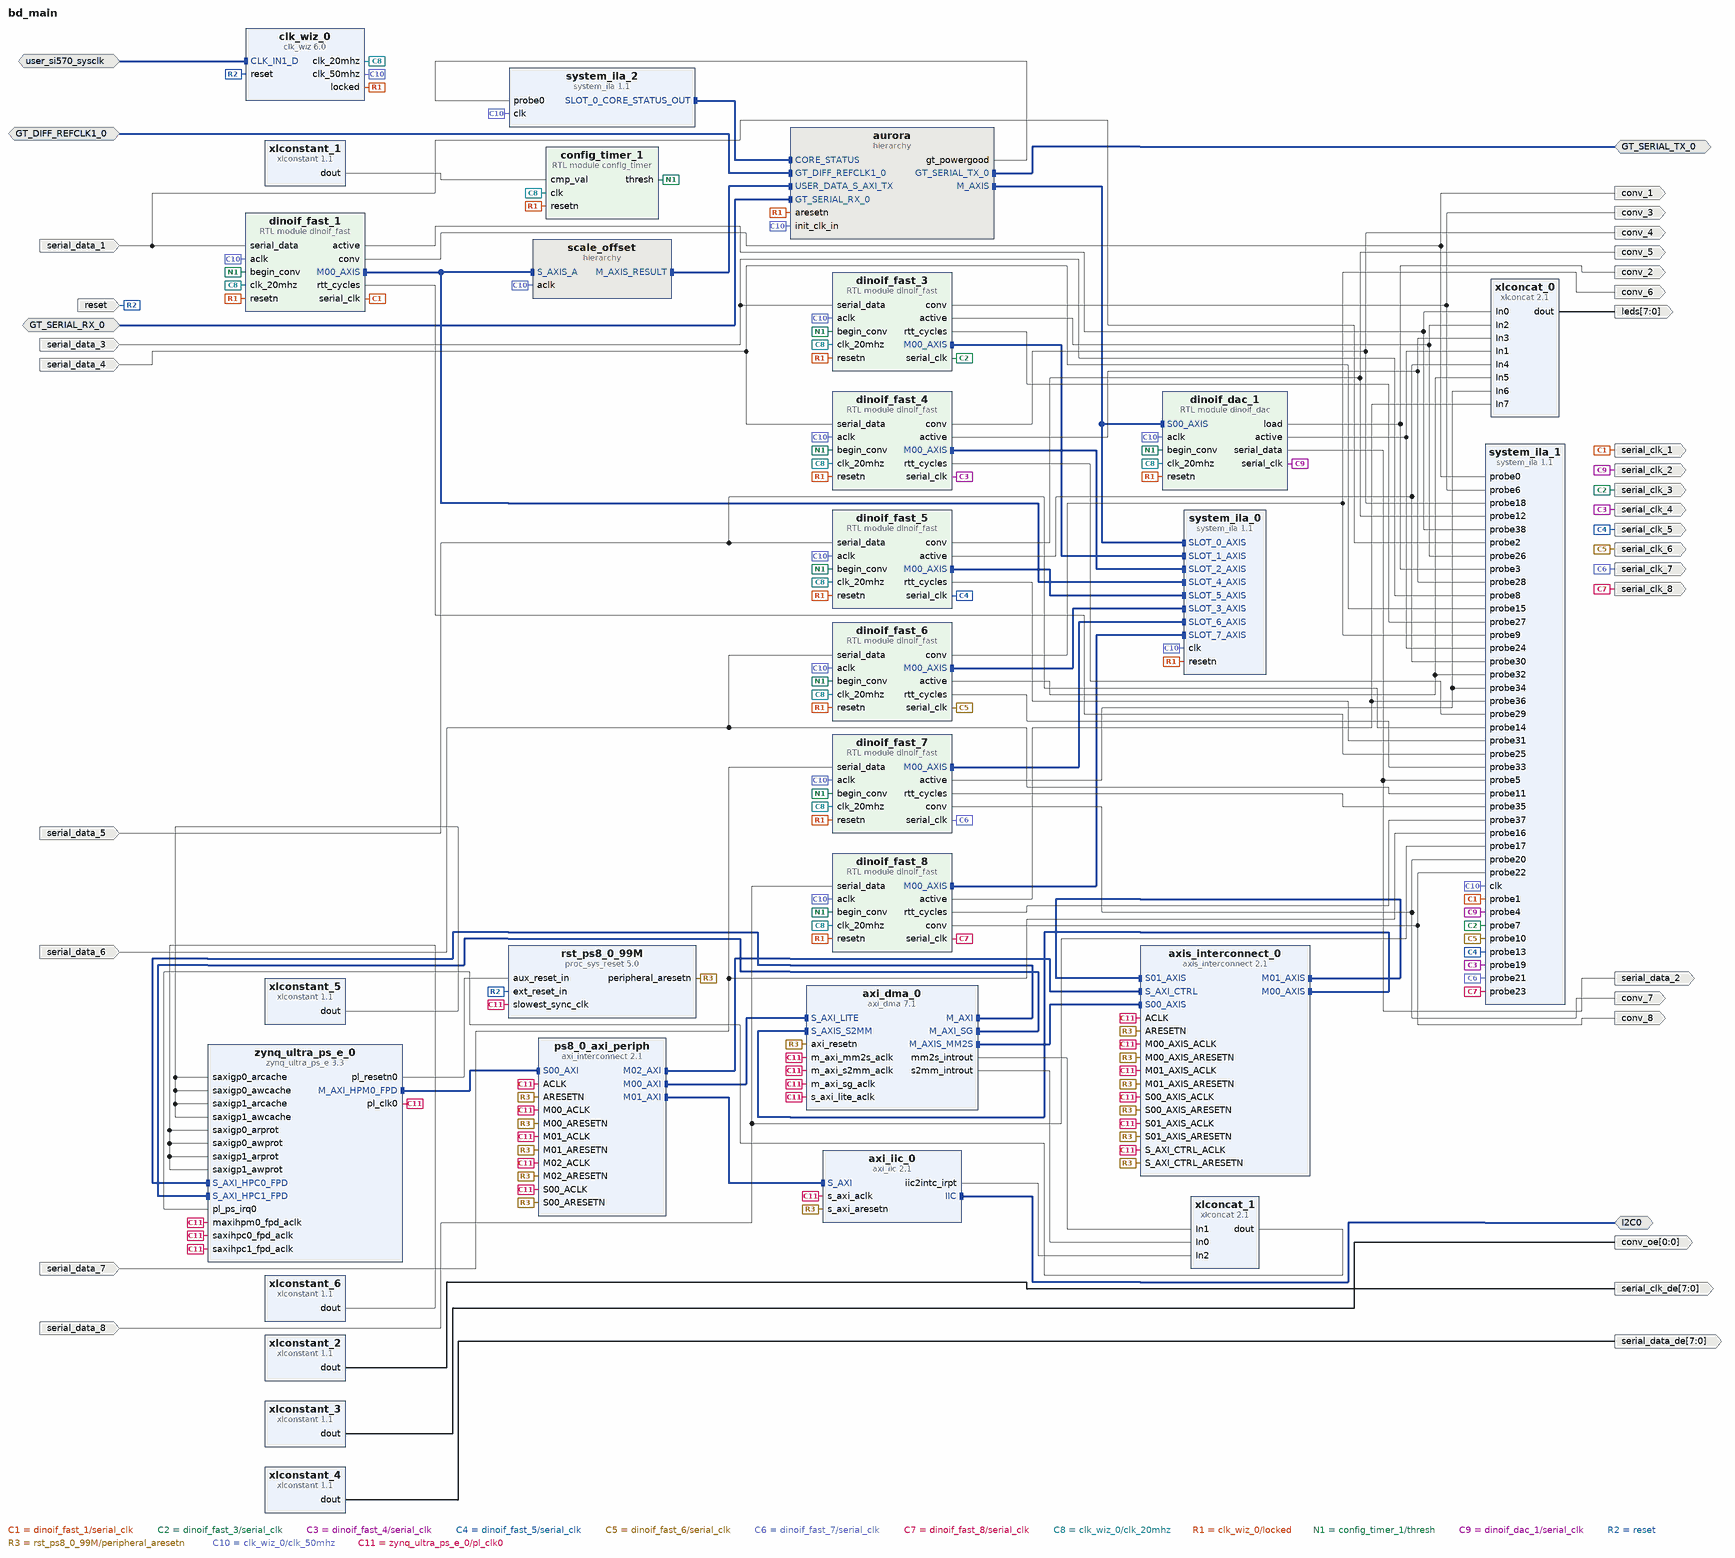
[diagram p0: block diagram of the top level]
# Vivado block design bd_main, xczu7ev-ffvc1156-2-e, Vivado 2021.1
create_bd_design bd_main

create_bd_intf_port -mode Slave -vlnv xilinx.com:interface:diff_clock_rtl:1.0 user_si570_sysclk
set_property -dict {CONFIG.FREQ_HZ 300000000} [get_bd_intf_ports user_si570_sysclk]
create_bd_intf_port -mode Slave -vlnv xilinx.com:display_aurora:GT_Serial_Transceiver_Pins_RX_rtl:1.0 GT_SERIAL_RX_0
create_bd_intf_port -mode Slave -vlnv xilinx.com:interface:diff_clock_rtl:1.0 GT_DIFF_REFCLK1_0
set_property -dict {CONFIG.FREQ_HZ 250000000} [get_bd_intf_ports GT_DIFF_REFCLK1_0]
create_bd_intf_port -mode Master -vlnv xilinx.com:display_aurora:GT_Serial_Transceiver_Pins_TX_rtl:1.0 GT_SERIAL_TX_0
create_bd_intf_port -mode Master -vlnv xilinx.com:interface:iic_rtl:1.0 I2C0
create_bd_port -dir O conv_3
create_bd_port -dir O conv_2
create_bd_port -dir O -type clk serial_clk_3
set_property -dict {CONFIG.FREQ_HZ 20000000} [get_bd_ports serial_clk_3]
create_bd_port -dir O -type clk serial_clk_2
create_bd_port -dir O -from 7 -to 0 serial_clk_de
create_bd_port -dir O -from 0 -to 0 conv_oe
create_bd_port -dir O -from 7 -to 0 serial_data_de
create_bd_port -dir O conv_1
create_bd_port -dir O -type clk serial_clk_1
set_property -dict {CONFIG.FREQ_HZ 20000000} [get_bd_ports serial_clk_1]
create_bd_port -dir O conv_5
create_bd_port -dir O -type clk serial_clk_5
set_property -dict {CONFIG.FREQ_HZ 20000000} [get_bd_ports serial_clk_5]
create_bd_port -dir O conv_6
create_bd_port -dir O -type clk serial_clk_6
set_property -dict {CONFIG.FREQ_HZ 20000000} [get_bd_ports serial_clk_6]
create_bd_port -dir I serial_data_5
create_bd_port -dir I serial_data_6
create_bd_port -dir I serial_data_1
create_bd_port -dir I serial_data_3
create_bd_port -dir I -type rst reset
set_property -dict {CONFIG.POLARITY ACTIVE_HIGH} [get_bd_ports reset]
create_bd_port -dir O conv_4
create_bd_port -dir O -type clk serial_clk_4
set_property -dict {CONFIG.FREQ_HZ 20000000} [get_bd_ports serial_clk_4]
create_bd_port -dir O conv_7
create_bd_port -dir O -type clk serial_clk_7
set_property -dict {CONFIG.FREQ_HZ 20000000} [get_bd_ports serial_clk_7]
create_bd_port -dir O conv_8
create_bd_port -dir O -type clk serial_clk_8
set_property -dict {CONFIG.FREQ_HZ 20000000} [get_bd_ports serial_clk_8]
create_bd_port -dir I serial_data_4
create_bd_port -dir I serial_data_7
create_bd_port -dir I serial_data_8
create_bd_port -dir O -from 7 -to 0 leds
create_bd_port -dir O serial_data_2

create_bd_cell -type module -reference config_timer config_timer_1
create_bd_cell -type ip -vlnv xilinx.com:ip:xlconstant:1.1 xlconstant_1
set_property -dict {CONFIG.CONST_VAL 1000 CONFIG.CONST_WIDTH 32} [get_bd_cells xlconstant_1]
create_bd_cell -type ip -vlnv xilinx.com:ip:system_ila:1.1 system_ila_0
set_property -dict [list \
  CONFIG.C_DATA_DEPTH 8192 \
  CONFIG.C_MON_TYPE INTERFACE \
  CONFIG.C_NUM_MONITOR_SLOTS 8 \
  CONFIG.C_NUM_OF_PROBES 0 \
  CONFIG.C_SLOT 2 \
  CONFIG.C_SLOT_0_INTF_TYPE xilinx.com:interface:axis_rtl:1.0 \
  CONFIG.C_SLOT_1_INTF_TYPE xilinx.com:interface:axis_rtl:1.0 \
  CONFIG.C_SLOT_2_INTF_TYPE xilinx.com:interface:axis_rtl:1.0 \
  CONFIG.C_SLOT_3_INTF_TYPE xilinx.com:interface:axis_rtl:1.0 \
  CONFIG.C_SLOT_4_INTF_TYPE xilinx.com:interface:axis_rtl:1.0 \
  CONFIG.C_SLOT_5_INTF_TYPE xilinx.com:interface:axis_rtl:1.0 \
  CONFIG.C_SLOT_6_INTF_TYPE xilinx.com:interface:axis_rtl:1.0 \
  CONFIG.C_SLOT_7_INTF_TYPE xilinx.com:interface:axis_rtl:1.0 \
  CONFIG.C_SLOT_8_INTF_TYPE xilinx.com:interface:axis_rtl:1.0 \
] [get_bd_cells system_ila_0]
create_bd_cell -type ip -vlnv xilinx.com:ip:xlconstant:1.1 xlconstant_2
set_property -dict {CONFIG.CONST_VAL 0xFF CONFIG.CONST_WIDTH 8} [get_bd_cells xlconstant_2]
create_bd_cell -type ip -vlnv xilinx.com:ip:system_ila:1.1 system_ila_1
set_property -dict {CONFIG.C_DATA_DEPTH 8192 CONFIG.C_MON_TYPE NATIVE CONFIG.C_NUM_OF_PROBES 39} [get_bd_cells system_ila_1]
create_bd_cell -type ip -vlnv xilinx.com:ip:xlconstant:1.1 xlconstant_3
set_property -dict {CONFIG.CONST_VAL 1 CONFIG.CONST_WIDTH 1} [get_bd_cells xlconstant_3]
create_bd_cell -type ip -vlnv xilinx.com:ip:xlconstant:1.1 xlconstant_4
set_property -dict {CONFIG.CONST_VAL 0b00000010 CONFIG.CONST_WIDTH 8} [get_bd_cells xlconstant_4]
create_bd_cell -type ip -vlnv xilinx.com:ip:clk_wiz:6.0 clk_wiz_0
set_property -dict [list \
  CONFIG.CLKIN1_JITTER_PS 33.330000000000005 \
  CONFIG.CLKOUT1_JITTER 140.023 \
  CONFIG.CLKOUT1_PHASE_ERROR 77.836 \
  CONFIG.CLKOUT1_REQUESTED_OUT_FREQ 20.000 \
  CONFIG.CLKOUT2_JITTER 116.415 \
  CONFIG.CLKOUT2_PHASE_ERROR 77.836 \
  CONFIG.CLKOUT2_REQUESTED_OUT_FREQ 50.000 \
  CONFIG.CLKOUT2_USED true \
  CONFIG.CLK_IN1_BOARD_INTERFACE user_si570_sysclk \
  CONFIG.CLK_OUT1_PORT clk_20mhz \
  CONFIG.CLK_OUT2_PORT clk_50mhz \
  CONFIG.MMCM_CLKFBOUT_MULT_F 4.000 \
  CONFIG.MMCM_CLKIN1_PERIOD 3.333 \
  CONFIG.MMCM_CLKIN2_PERIOD 10.0 \
  CONFIG.MMCM_CLKOUT0_DIVIDE_F 60.000 \
  CONFIG.MMCM_CLKOUT1_DIVIDE 24 \
  CONFIG.MMCM_DIVCLK_DIVIDE 1 \
  CONFIG.NUM_OUT_CLKS 2 \
  CONFIG.PRIM_SOURCE Differential_clock_capable_pin \
  CONFIG.RESET_BOARD_INTERFACE reset \
  CONFIG.USE_BOARD_FLOW true \
] [get_bd_cells clk_wiz_0]
create_bd_cell -type hier scale_offset
create_bd_cell -type ip -vlnv xilinx.com:ip:system_ila:1.1 system_ila_2
set_property -dict [list \
  CONFIG.C_DATA_DEPTH 8192 \
  CONFIG.C_MON_TYPE MIX \
  CONFIG.C_NUM_MONITOR_SLOTS 1 \
  CONFIG.C_NUM_OF_PROBES 1 \
  CONFIG.C_SLOT_0_INTF_TYPE xilinx.com:display_aurora:core_status_out_rtl:1.0 \
] [get_bd_cells system_ila_2]
create_bd_cell -type hier aurora
create_bd_cell -type ip -vlnv xilinx.com:ip:xlconcat:2.1 xlconcat_0
set_property -dict {CONFIG.NUM_PORTS 8} [get_bd_cells xlconcat_0]
create_bd_cell -type ip -vlnv xilinx.com:ip:proc_sys_reset:5.0 rst_ps8_0_99M
set_property -dict {CONFIG.RESET_BOARD_INTERFACE reset CONFIG.USE_BOARD_FLOW true} [get_bd_cells rst_ps8_0_99M]
create_bd_cell -type ip -vlnv xilinx.com:ip:zynq_ultra_ps_e:3.3 zynq_ultra_ps_e_0
set_property -dict [list \
  CONFIG.PSU_BANK_0_IO_STANDARD LVCMOS18 \
  CONFIG.PSU_BANK_1_IO_STANDARD LVCMOS18 \
  CONFIG.PSU_BANK_2_IO_STANDARD LVCMOS18 \
  CONFIG.PSU_DYNAMIC_DDR_CONFIG_EN 1 \
  CONFIG.PSU_USB3__DUAL_CLOCK_ENABLE 1 \
  CONFIG.PSU__CAN1__PERIPHERAL__ENABLE 1 \
  CONFIG.PSU__CAN1__PERIPHERAL__IO {MIO 24 .. 25} \
  CONFIG.PSU__CRF_APB__ACPU_CTRL__FREQMHZ 1200 \
  CONFIG.PSU__CRF_APB__ACPU_CTRL__SRCSEL APLL \
  CONFIG.PSU__CRF_APB__APLL_CTRL__SRCSEL PSS_REF_CLK \
  CONFIG.PSU__CRF_APB__DBG_FPD_CTRL__FREQMHZ 250 \
  CONFIG.PSU__CRF_APB__DBG_FPD_CTRL__SRCSEL IOPLL \
  CONFIG.PSU__CRF_APB__DBG_TRACE_CTRL__FREQMHZ 250 \
  CONFIG.PSU__CRF_APB__DBG_TRACE_CTRL__SRCSEL IOPLL \
  CONFIG.PSU__CRF_APB__DBG_TSTMP_CTRL__FREQMHZ 250 \
  CONFIG.PSU__CRF_APB__DBG_TSTMP_CTRL__SRCSEL IOPLL \
  CONFIG.PSU__CRF_APB__DDR_CTRL__FREQMHZ 1067 \
  CONFIG.PSU__CRF_APB__DDR_CTRL__SRCSEL DPLL \
  CONFIG.PSU__CRF_APB__DPDMA_REF_CTRL__FREQMHZ 600 \
  CONFIG.PSU__CRF_APB__DPDMA_REF_CTRL__SRCSEL APLL \
  CONFIG.PSU__CRF_APB__DPLL_CTRL__SRCSEL PSS_REF_CLK \
  CONFIG.PSU__CRF_APB__DP_AUDIO_REF_CTRL__SRCSEL RPLL \
  CONFIG.PSU__CRF_APB__DP_STC_REF_CTRL__SRCSEL RPLL \
  CONFIG.PSU__CRF_APB__DP_VIDEO_REF_CTRL__SRCSEL VPLL \
  CONFIG.PSU__CRF_APB__GDMA_REF_CTRL__FREQMHZ 600 \
  CONFIG.PSU__CRF_APB__GDMA_REF_CTRL__SRCSEL APLL \
  CONFIG.PSU__CRF_APB__GPU_REF_CTRL__FREQMHZ 500 \
  CONFIG.PSU__CRF_APB__GPU_REF_CTRL__SRCSEL IOPLL \
  CONFIG.PSU__CRF_APB__TOPSW_LSBUS_CTRL__FREQMHZ 100 \
  CONFIG.PSU__CRF_APB__TOPSW_LSBUS_CTRL__SRCSEL IOPLL \
  CONFIG.PSU__CRF_APB__TOPSW_MAIN_CTRL__FREQMHZ 533.33 \
  CONFIG.PSU__CRF_APB__TOPSW_MAIN_CTRL__SRCSEL DPLL \
  CONFIG.PSU__CRF_APB__VPLL_CTRL__SRCSEL PSS_REF_CLK \
  CONFIG.PSU__CRL_APB__ADMA_REF_CTRL__FREQMHZ 500 \
  CONFIG.PSU__CRL_APB__ADMA_REF_CTRL__SRCSEL IOPLL \
  CONFIG.PSU__CRL_APB__CAN1_REF_CTRL__FREQMHZ 100 \
  CONFIG.PSU__CRL_APB__CAN1_REF_CTRL__SRCSEL IOPLL \
  CONFIG.PSU__CRL_APB__CPU_R5_CTRL__FREQMHZ 500 \
  CONFIG.PSU__CRL_APB__CPU_R5_CTRL__SRCSEL IOPLL \
  CONFIG.PSU__CRL_APB__DBG_LPD_CTRL__FREQMHZ 250 \
  CONFIG.PSU__CRL_APB__DBG_LPD_CTRL__SRCSEL IOPLL \
  CONFIG.PSU__CRL_APB__GEM3_REF_CTRL__FREQMHZ 125 \
  CONFIG.PSU__CRL_APB__GEM3_REF_CTRL__SRCSEL IOPLL \
  CONFIG.PSU__CRL_APB__I2C0_REF_CTRL__FREQMHZ 100 \
  CONFIG.PSU__CRL_APB__I2C0_REF_CTRL__SRCSEL IOPLL \
  CONFIG.PSU__CRL_APB__I2C1_REF_CTRL__FREQMHZ 100 \
  CONFIG.PSU__CRL_APB__I2C1_REF_CTRL__SRCSEL IOPLL \
  CONFIG.PSU__CRL_APB__IOPLL_CTRL__SRCSEL PSS_REF_CLK \
  CONFIG.PSU__CRL_APB__IOU_SWITCH_CTRL__FREQMHZ 250 \
  CONFIG.PSU__CRL_APB__IOU_SWITCH_CTRL__SRCSEL IOPLL \
  CONFIG.PSU__CRL_APB__LPD_LSBUS_CTRL__FREQMHZ 100 \
  CONFIG.PSU__CRL_APB__LPD_LSBUS_CTRL__SRCSEL IOPLL \
  CONFIG.PSU__CRL_APB__LPD_SWITCH_CTRL__FREQMHZ 500 \
  CONFIG.PSU__CRL_APB__LPD_SWITCH_CTRL__SRCSEL IOPLL \
  CONFIG.PSU__CRL_APB__PCAP_CTRL__FREQMHZ 200 \
  CONFIG.PSU__CRL_APB__PCAP_CTRL__SRCSEL IOPLL \
  CONFIG.PSU__CRL_APB__PL0_REF_CTRL__FREQMHZ 50 \
  CONFIG.PSU__CRL_APB__PL0_REF_CTRL__SRCSEL IOPLL \
  CONFIG.PSU__CRL_APB__QSPI_REF_CTRL__FREQMHZ 125 \
  CONFIG.PSU__CRL_APB__QSPI_REF_CTRL__SRCSEL IOPLL \
  CONFIG.PSU__CRL_APB__RPLL_CTRL__SRCSEL PSS_REF_CLK \
  CONFIG.PSU__CRL_APB__SDIO1_REF_CTRL__FREQMHZ 200 \
  CONFIG.PSU__CRL_APB__SDIO1_REF_CTRL__SRCSEL IOPLL \
  CONFIG.PSU__CRL_APB__TIMESTAMP_REF_CTRL__FREQMHZ 100 \
  CONFIG.PSU__CRL_APB__TIMESTAMP_REF_CTRL__SRCSEL IOPLL \
  CONFIG.PSU__CRL_APB__UART0_REF_CTRL__FREQMHZ 100 \
  CONFIG.PSU__CRL_APB__UART0_REF_CTRL__SRCSEL IOPLL \
  CONFIG.PSU__CRL_APB__UART1_REF_CTRL__FREQMHZ 100 \
  CONFIG.PSU__CRL_APB__UART1_REF_CTRL__SRCSEL IOPLL \
  CONFIG.PSU__CRL_APB__USB0_BUS_REF_CTRL__FREQMHZ 250 \
  CONFIG.PSU__CRL_APB__USB0_BUS_REF_CTRL__SRCSEL IOPLL \
  CONFIG.PSU__CRL_APB__USB3_DUAL_REF_CTRL__FREQMHZ 20 \
  CONFIG.PSU__CRL_APB__USB3_DUAL_REF_CTRL__SRCSEL IOPLL \
  CONFIG.PSU__CRL_APB__USB3__ENABLE 1 \
  CONFIG.PSU__CSUPMU__PERIPHERAL__VALID 1 \
  CONFIG.PSU__DDRC__BUS_WIDTH {64 Bit} \
  CONFIG.PSU__DDRC__COMPONENTS UDIMM \
  CONFIG.PSU__DDRC__DEVICE_CAPACITY {4096 MBits} \
  CONFIG.PSU__DDRC__DRAM_WIDTH {8 Bits} \
  CONFIG.PSU__DDRC__ECC Disabled \
  CONFIG.PSU__DDRC__MEMORY_TYPE {DDR 4} \
  CONFIG.PSU__DDRC__SPEED_BIN DDR4_2133P \
  CONFIG.PSU__DDR_HIGH_ADDRESS_GUI_ENABLE 1 \
  CONFIG.PSU__DDR__INTERFACE__FREQMHZ 533.500 \
  CONFIG.PSU__DISPLAYPORT__LANE0__ENABLE 1 \
  CONFIG.PSU__DISPLAYPORT__LANE0__IO {GT Lane1} \
  CONFIG.PSU__DISPLAYPORT__LANE1__ENABLE 1 \
  CONFIG.PSU__DISPLAYPORT__LANE1__IO {GT Lane0} \
  CONFIG.PSU__DISPLAYPORT__PERIPHERAL__ENABLE 1 \
  CONFIG.PSU__DLL__ISUSED 1 \
  CONFIG.PSU__DPAUX__PERIPHERAL__ENABLE 1 \
  CONFIG.PSU__DPAUX__PERIPHERAL__IO {MIO 27 .. 30} \
  CONFIG.PSU__DP__LANE_SEL {Dual Lower} \
  CONFIG.PSU__DP__REF_CLK_FREQ 27 \
  CONFIG.PSU__DP__REF_CLK_SEL {Ref Clk3} \
  CONFIG.PSU__ENET3__FIFO__ENABLE 0 \
  CONFIG.PSU__ENET3__GRP_MDIO__ENABLE 1 \
  CONFIG.PSU__ENET3__GRP_MDIO__IO {MIO 76 .. 77} \
  CONFIG.PSU__ENET3__PERIPHERAL__ENABLE 1 \
  CONFIG.PSU__ENET3__PERIPHERAL__IO {MIO 64 .. 75} \
  CONFIG.PSU__ENET3__PTP__ENABLE 0 \
  CONFIG.PSU__ENET3__TSU__ENABLE 0 \
  CONFIG.PSU__FPGA_PL0_ENABLE 1 \
  CONFIG.PSU__GEM3_COHERENCY 0 \
  CONFIG.PSU__GEM3_ROUTE_THROUGH_FPD 0 \
  CONFIG.PSU__GEM__TSU__ENABLE 0 \
  CONFIG.PSU__GPIO0_MIO__IO {MIO 0 .. 25} \
  CONFIG.PSU__GPIO0_MIO__PERIPHERAL__ENABLE 1 \
  CONFIG.PSU__GPIO1_MIO__IO {MIO 26 .. 51} \
  CONFIG.PSU__GPIO1_MIO__PERIPHERAL__ENABLE 1 \
  CONFIG.PSU__GT__LINK_SPEED HBR \
  CONFIG.PSU__GT__PRE_EMPH_LVL_4 0 \
  CONFIG.PSU__GT__VLT_SWNG_LVL_4 0 \
  CONFIG.PSU__I2C0__PERIPHERAL__ENABLE 1 \
  CONFIG.PSU__I2C0__PERIPHERAL__IO {MIO 14 .. 15} \
  CONFIG.PSU__I2C1__PERIPHERAL__ENABLE 1 \
  CONFIG.PSU__I2C1__PERIPHERAL__IO {MIO 16 .. 17} \
  CONFIG.PSU__IOU_SLCR__IOU_TTC_APB_CLK__TTC0_SEL APB \
  CONFIG.PSU__IOU_SLCR__IOU_TTC_APB_CLK__TTC1_SEL APB \
  CONFIG.PSU__IOU_SLCR__IOU_TTC_APB_CLK__TTC2_SEL APB \
  CONFIG.PSU__IOU_SLCR__IOU_TTC_APB_CLK__TTC3_SEL APB \
  CONFIG.PSU__MAXIGP0__DATA_WIDTH 128 \
  CONFIG.PSU__OVERRIDE__BASIC_CLOCK 0 \
  CONFIG.PSU__PMU_COHERENCY 0 \
  CONFIG.PSU__PMU__AIBACK__ENABLE 0 \
  CONFIG.PSU__PMU__EMIO_GPI__ENABLE 0 \
  CONFIG.PSU__PMU__EMIO_GPO__ENABLE 0 \
  CONFIG.PSU__PMU__GPI0__ENABLE 0 \
  CONFIG.PSU__PMU__GPI1__ENABLE 0 \
  CONFIG.PSU__PMU__GPI2__ENABLE 0 \
  CONFIG.PSU__PMU__GPI3__ENABLE 0 \
  CONFIG.PSU__PMU__GPI4__ENABLE 0 \
  CONFIG.PSU__PMU__GPI5__ENABLE 0 \
  CONFIG.PSU__PMU__GPO0__ENABLE 0 \
  CONFIG.PSU__PMU__GPO1__ENABLE 0 \
  CONFIG.PSU__PMU__GPO2__ENABLE 0 \
  CONFIG.PSU__PMU__GPO3__ENABLE 0 \
  CONFIG.PSU__PMU__GPO4__ENABLE 0 \
  CONFIG.PSU__PMU__GPO5__ENABLE 0 \
  CONFIG.PSU__PMU__PERIPHERAL__ENABLE 1 \
  CONFIG.PSU__PMU__PLERROR__ENABLE 0 \
  CONFIG.PSU__PRESET_APPLIED 1 \
  CONFIG.PSU__PSS_REF_CLK__FREQMHZ 33.330 \
  CONFIG.PSU__QSPI_COHERENCY 0 \
  CONFIG.PSU__QSPI_ROUTE_THROUGH_FPD 0 \
  CONFIG.PSU__QSPI__GRP_FBCLK__ENABLE 1 \
  CONFIG.PSU__QSPI__GRP_FBCLK__IO {MIO 6} \
  CONFIG.PSU__QSPI__PERIPHERAL__DATA_MODE x4 \
  CONFIG.PSU__QSPI__PERIPHERAL__ENABLE 1 \
  CONFIG.PSU__QSPI__PERIPHERAL__IO {MIO 0 .. 12} \
  CONFIG.PSU__QSPI__PERIPHERAL__MODE {Dual Parallel} \
  CONFIG.PSU__SATA__LANE1__IO {GT Lane3} \
  CONFIG.PSU__SATA__PERIPHERAL__ENABLE 1 \
  CONFIG.PSU__SATA__REF_CLK_FREQ 125 \
  CONFIG.PSU__SATA__REF_CLK_SEL {Ref Clk1} \
  CONFIG.PSU__SAXIGP1__DATA_WIDTH 32 \
  CONFIG.PSU__SD1_COHERENCY 0 \
  CONFIG.PSU__SD1_ROUTE_THROUGH_FPD 0 \
  CONFIG.PSU__SD1__DATA_TRANSFER_MODE 8Bit \
  CONFIG.PSU__SD1__GRP_CD__ENABLE 1 \
  CONFIG.PSU__SD1__GRP_CD__IO {MIO 45} \
  CONFIG.PSU__SD1__GRP_POW__ENABLE 1 \
  CONFIG.PSU__SD1__GRP_POW__IO {MIO 43} \
  CONFIG.PSU__SD1__GRP_WP__ENABLE 1 \
  CONFIG.PSU__SD1__GRP_WP__IO {MIO 44} \
  CONFIG.PSU__SD1__PERIPHERAL__ENABLE 1 \
  CONFIG.PSU__SD1__PERIPHERAL__IO {MIO 39 .. 51} \
  CONFIG.PSU__SD1__SLOT_TYPE {SD 3.0} \
  CONFIG.PSU__SWDT0__CLOCK__ENABLE 0 \
  CONFIG.PSU__SWDT0__PERIPHERAL__ENABLE 1 \
  CONFIG.PSU__SWDT0__RESET__ENABLE 0 \
  CONFIG.PSU__SWDT1__CLOCK__ENABLE 0 \
  CONFIG.PSU__SWDT1__PERIPHERAL__ENABLE 1 \
  CONFIG.PSU__SWDT1__RESET__ENABLE 0 \
  CONFIG.PSU__TSU__BUFG_PORT_PAIR 0 \
  CONFIG.PSU__TTC0__CLOCK__ENABLE 0 \
  CONFIG.PSU__TTC0__PERIPHERAL__ENABLE 1 \
  CONFIG.PSU__TTC0__WAVEOUT__ENABLE 0 \
  CONFIG.PSU__TTC1__CLOCK__ENABLE 0 \
  CONFIG.PSU__TTC1__PERIPHERAL__ENABLE 1 \
  CONFIG.PSU__TTC1__WAVEOUT__ENABLE 0 \
  CONFIG.PSU__TTC2__CLOCK__ENABLE 0 \
  CONFIG.PSU__TTC2__PERIPHERAL__ENABLE 1 \
  CONFIG.PSU__TTC2__WAVEOUT__ENABLE 0 \
  CONFIG.PSU__TTC3__CLOCK__ENABLE 0 \
  CONFIG.PSU__TTC3__PERIPHERAL__ENABLE 1 \
  CONFIG.PSU__TTC3__WAVEOUT__ENABLE 0 \
  CONFIG.PSU__UART0__BAUD_RATE 115200 \
  CONFIG.PSU__UART0__MODEM__ENABLE 0 \
  CONFIG.PSU__UART0__PERIPHERAL__ENABLE 1 \
  CONFIG.PSU__UART0__PERIPHERAL__IO {MIO 18 .. 19} \
  CONFIG.PSU__UART1__BAUD_RATE 115200 \
  CONFIG.PSU__UART1__MODEM__ENABLE 0 \
  CONFIG.PSU__UART1__PERIPHERAL__ENABLE 1 \
  CONFIG.PSU__UART1__PERIPHERAL__IO {MIO 20 .. 21} \
  CONFIG.PSU__USB0_COHERENCY 0 \
  CONFIG.PSU__USB0__PERIPHERAL__ENABLE 1 \
  CONFIG.PSU__USB0__PERIPHERAL__IO {MIO 52 .. 63} \
  CONFIG.PSU__USB0__REF_CLK_FREQ 26 \
  CONFIG.PSU__USB0__REF_CLK_SEL {Ref Clk2} \
  CONFIG.PSU__USB2_0__EMIO__ENABLE 0 \
  CONFIG.PSU__USB3_0__EMIO__ENABLE 0 \
  CONFIG.PSU__USB3_0__PERIPHERAL__ENABLE 1 \
  CONFIG.PSU__USB3_0__PERIPHERAL__IO {GT Lane2} \
  CONFIG.PSU__USB__RESET__MODE {Boot Pin} \
  CONFIG.PSU__USB__RESET__POLARITY {Active Low} \
  CONFIG.PSU__USE__IRQ0 1 \
  CONFIG.PSU__USE__M_AXI_GP0 1 \
  CONFIG.PSU__USE__M_AXI_GP1 0 \
  CONFIG.PSU__USE__M_AXI_GP2 0 \
  CONFIG.PSU__USE__S_AXI_GP0 1 \
  CONFIG.PSU__USE__S_AXI_GP1 1 \
] [get_bd_cells zynq_ultra_ps_e_0]
# 108 more settings of zynq_ultra_ps_e_0 are not shown: defaults, MIO pin electricals, DDR timing, and values the tool derives
create_bd_cell -type ip -vlnv xilinx.com:ip:axi_dma:7.1 axi_dma_0
set_property -dict [list \
  CONFIG.c_addr_width 64 \
  CONFIG.c_include_mm2s 1 \
  CONFIG.c_include_mm2s_dre 0 \
  CONFIG.c_m_axi_mm2s_data_width 128 \
  CONFIG.c_m_axi_s2mm_data_width 128 \
  CONFIG.c_m_axis_mm2s_tdata_width 128 \
  CONFIG.c_mm2s_burst_size 16 \
  CONFIG.c_s_axis_s2mm_tdata_width 128 \
  CONFIG.c_sg_include_stscntrl_strm 0 \
  CONFIG.c_sg_length_width 23 \
  CONFIG.c_single_interface 1 \
] [get_bd_cells axi_dma_0]
create_bd_cell -type ip -vlnv xilinx.com:ip:xlconstant:1.1 xlconstant_5
set_property -dict {CONFIG.CONST_VAL 15 CONFIG.CONST_WIDTH 4} [get_bd_cells xlconstant_5]
create_bd_cell -type ip -vlnv xilinx.com:ip:xlconstant:1.1 xlconstant_6
set_property -dict {CONFIG.CONST_VAL 2 CONFIG.CONST_WIDTH 3} [get_bd_cells xlconstant_6]
create_bd_cell -type ip -vlnv xilinx.com:ip:xlconcat:2.1 xlconcat_1
set_property -dict {CONFIG.NUM_PORTS 3} [get_bd_cells xlconcat_1]
create_bd_cell -type ip -vlnv xilinx.com:ip:axi_iic:2.1 axi_iic_0
create_bd_cell -type ip -vlnv xilinx.com:ip:axi_interconnect:2.1 ps8_0_axi_periph
set_property -dict {CONFIG.NUM_MI 3} [get_bd_cells ps8_0_axi_periph]
create_bd_cell -type ip -vlnv xilinx.com:ip:axis_interconnect:2.1 axis_interconnect_0
set_property -dict [list \
  CONFIG.ENABLE_ADVANCED_OPTIONS 1 \
  CONFIG.M00_FIFO_DEPTH 4096 \
  CONFIG.M00_FIFO_MODE 1 \
  CONFIG.M01_FIFO_DEPTH 4096 \
  CONFIG.M01_FIFO_MODE 1 \
  CONFIG.NUM_SI 2 \
  CONFIG.ROUTING_MODE 1 \
  CONFIG.S00_FIFO_DEPTH 4096 \
  CONFIG.S00_FIFO_MODE 1 \
  CONFIG.S01_FIFO_DEPTH 4096 \
  CONFIG.S01_FIFO_MODE 1 \
] [get_bd_cells axis_interconnect_0]
create_bd_cell -type module -reference dinoif_dac dinoif_dac_1
create_bd_cell -type module -reference dinoif_fast dinoif_fast_3
create_bd_cell -type module -reference dinoif_fast dinoif_fast_1
create_bd_cell -type module -reference dinoif_fast dinoif_fast_5
create_bd_cell -type module -reference dinoif_fast dinoif_fast_6
create_bd_cell -type module -reference dinoif_fast dinoif_fast_4
create_bd_cell -type module -reference dinoif_fast dinoif_fast_7
create_bd_cell -type module -reference dinoif_fast dinoif_fast_8

# ---- hierarchy /scale_offset ----
current_bd_instance /scale_offset
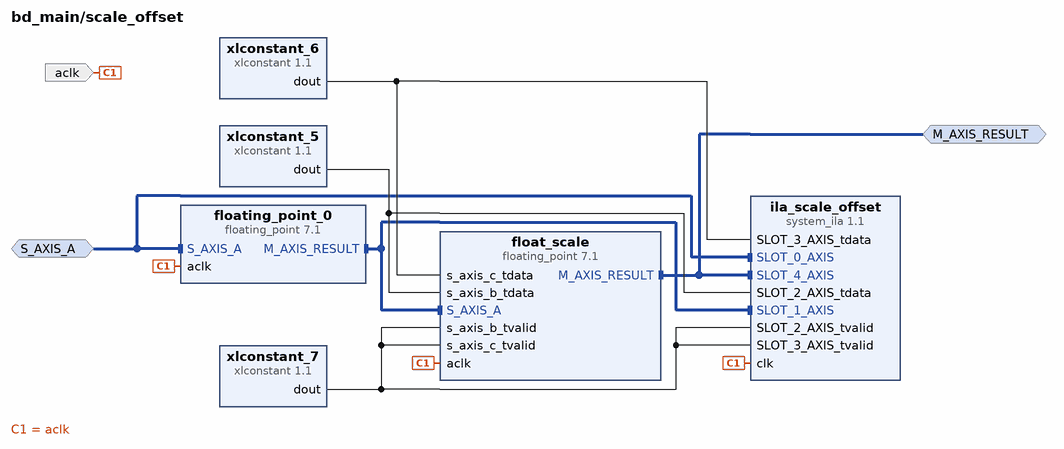
[diagram p1: block diagram inside /scale_offset]
create_bd_intf_pin -mode Slave -vlnv xilinx.com:interface:axis_rtl:1.0 S_AXIS_A
create_bd_intf_pin -mode Master -vlnv xilinx.com:interface:axis_rtl:1.0 M_AXIS_RESULT
create_bd_pin -dir I -type clk aclk

create_bd_cell -type ip -vlnv xilinx.com:ip:floating_point:7.1 floating_point_0
set_property -dict [list \
  CONFIG.A_Precision_Type Custom \
  CONFIG.Add_Sub_Value Both \
  CONFIG.C_A_Exponent_Width 16 \
  CONFIG.C_Accum_Input_Msb 32 \
  CONFIG.C_Accum_Lsb -31 \
  CONFIG.C_Accum_Msb 32 \
  CONFIG.C_Latency 6 \
  CONFIG.C_Mult_Usage No_Usage \
  CONFIG.C_Rate 1 \
  CONFIG.C_Result_Exponent_Width 8 \
  CONFIG.C_Result_Fraction_Width 24 \
  CONFIG.Flow_Control NonBlocking \
  CONFIG.Has_A_TLAST true \
  CONFIG.Has_RESULT_TREADY false \
  CONFIG.Maximum_Latency true \
  CONFIG.Operation_Type Fixed_to_float \
  CONFIG.RESULT_TLAST_Behv Pass_A_TLAST \
  CONFIG.Result_Precision_Type Single \
] [get_bd_cells floating_point_0]
create_bd_cell -type ip -vlnv xilinx.com:ip:xlconstant:1.1 xlconstant_5
set_property -dict {CONFIG.CONST_VAL 0xbad3b6ee CONFIG.CONST_WIDTH 32} [get_bd_cells xlconstant_5]
create_bd_cell -type ip -vlnv xilinx.com:ip:xlconstant:1.1 xlconstant_6
set_property -dict {CONFIG.CONST_VAL 0x412ce5c9 CONFIG.CONST_WIDTH 32} [get_bd_cells xlconstant_6]
create_bd_cell -type ip -vlnv xilinx.com:ip:xlconstant:1.1 xlconstant_7
create_bd_cell -type ip -vlnv xilinx.com:ip:floating_point:7.1 float_scale
set_property -dict [list \
  CONFIG.A_Precision_Type Single \
  CONFIG.Add_Sub_Value Add \
  CONFIG.C_A_Exponent_Width 8 \
  CONFIG.C_A_Fraction_Width 24 \
  CONFIG.C_Accum_Input_Msb 32 \
  CONFIG.C_Accum_Lsb -31 \
  CONFIG.C_Accum_Msb 32 \
  CONFIG.C_Latency 16 \
  CONFIG.C_Mult_Usage Medium_Usage \
  CONFIG.C_Rate 1 \
  CONFIG.C_Result_Exponent_Width 8 \
  CONFIG.C_Result_Fraction_Width 24 \
  CONFIG.Flow_Control NonBlocking \
  CONFIG.Has_A_TLAST true \
  CONFIG.Has_RESULT_TREADY false \
  CONFIG.Operation_Type FMA \
  CONFIG.RESULT_TLAST_Behv Pass_A_TLAST \
  CONFIG.Result_Precision_Type Single \
] [get_bd_cells float_scale]
create_bd_cell -type ip -vlnv xilinx.com:ip:system_ila:1.1 ila_scale_offset
set_property -dict [list \
  CONFIG.C_DATA_DEPTH 4096 \
  CONFIG.C_NUM_MONITOR_SLOTS 5 \
  CONFIG.C_SLOT 3 \
  CONFIG.C_SLOT_0_INTF_TYPE xilinx.com:interface:axis_rtl:1.0 \
  CONFIG.C_SLOT_1_INTF_TYPE xilinx.com:interface:axis_rtl:1.0 \
  CONFIG.C_SLOT_2_AXIS_TDATA_WIDTH 32 \
  CONFIG.C_SLOT_2_INTF_TYPE xilinx.com:interface:axis_rtl:1.0 \
  CONFIG.C_SLOT_3_AXIS_TDATA_WIDTH 32 \
  CONFIG.C_SLOT_3_INTF_TYPE xilinx.com:interface:axis_rtl:1.0 \
  CONFIG.C_SLOT_4_INTF_TYPE xilinx.com:interface:axis_rtl:1.0 \
] [get_bd_cells ila_scale_offset]

# ---- hierarchy /aurora ----
current_bd_instance /aurora
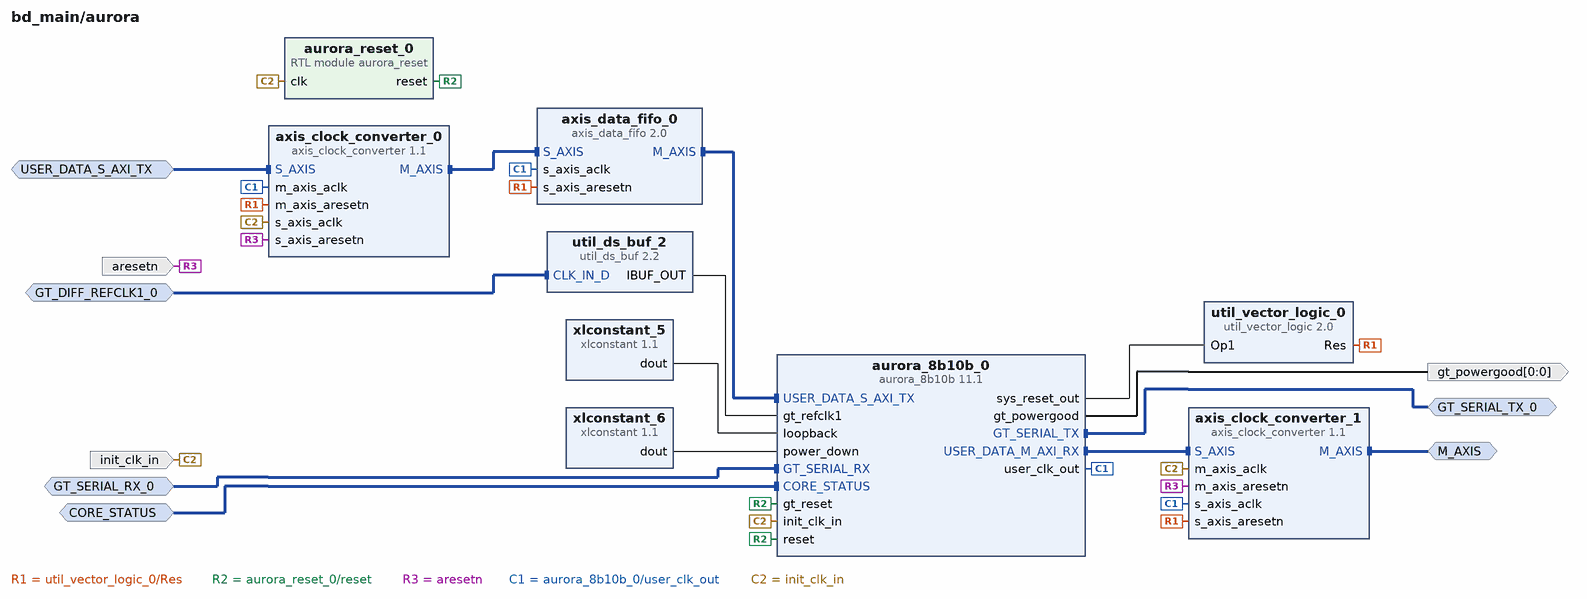
[diagram p2: block diagram inside /aurora]
create_bd_intf_pin -mode Slave -vlnv xilinx.com:interface:axis_rtl:1.0 USER_DATA_S_AXI_TX
create_bd_intf_pin -mode Monitor -vlnv xilinx.com:display_aurora:core_status_out_rtl:1.0 CORE_STATUS
create_bd_intf_pin -mode Master -vlnv xilinx.com:display_aurora:GT_Serial_Transceiver_Pins_TX_rtl:1.0 GT_SERIAL_TX_0
create_bd_intf_pin -mode Slave -vlnv xilinx.com:display_aurora:GT_Serial_Transceiver_Pins_RX_rtl:1.0 GT_SERIAL_RX_0
create_bd_intf_pin -mode Slave -vlnv xilinx.com:interface:diff_clock_rtl:1.0 GT_DIFF_REFCLK1_0
create_bd_intf_pin -mode Master -vlnv xilinx.com:interface:axis_rtl:1.0 M_AXIS
create_bd_pin -dir I -type clk init_clk_in
create_bd_pin -dir O -from 0 -to 0 gt_powergood
create_bd_pin -dir I -type rst aresetn

create_bd_cell -type ip -vlnv xilinx.com:ip:util_ds_buf:2.2 util_ds_buf_2
set_property -dict {CONFIG.C_BUF_TYPE IBUFDSGTE} [get_bd_cells util_ds_buf_2]
create_bd_cell -type ip -vlnv xilinx.com:ip:xlconstant:1.1 xlconstant_5
set_property -dict {CONFIG.CONST_VAL 0 CONFIG.CONST_WIDTH 3} [get_bd_cells xlconstant_5]
create_bd_cell -type ip -vlnv xilinx.com:ip:xlconstant:1.1 xlconstant_6
set_property -dict {CONFIG.CONST_VAL 0} [get_bd_cells xlconstant_6]
create_bd_cell -type ip -vlnv xilinx.com:ip:axis_clock_converter:1.1 axis_clock_converter_0
create_bd_cell -type ip -vlnv xilinx.com:ip:util_vector_logic:2.0 util_vector_logic_0
set_property -dict {CONFIG.C_OPERATION not CONFIG.C_SIZE 1} [get_bd_cells util_vector_logic_0]
create_bd_cell -type module -reference aurora_reset aurora_reset_0
create_bd_cell -type ip -vlnv xilinx.com:ip:axis_data_fifo:2.0 axis_data_fifo_0
set_property -dict {CONFIG.FIFO_DEPTH 4096} [get_bd_cells axis_data_fifo_0]
create_bd_cell -type ip -vlnv xilinx.com:ip:aurora_8b10b:11.1 aurora_8b10b_0
set_property -dict [list \
  CONFIG.CHANNEL_ENABLE X0Y10 \
  CONFIG.C_DRP_IF true \
  CONFIG.C_LANE_WIDTH 4 \
  CONFIG.C_LINE_RATE 2 \
  CONFIG.C_REFCLK_FREQUENCY 250 \
  CONFIG.C_REFCLK_SOURCE {MGTREFCLK1 of Quad X0Y2} \
  CONFIG.C_START_LANE X0Y10 \
  CONFIG.C_START_QUAD Quad_X0Y2 \
  CONFIG.SINGLEEND_GTREFCLK true \
  CONFIG.SupportLevel 1 \
] [get_bd_cells aurora_8b10b_0]
create_bd_cell -type ip -vlnv xilinx.com:ip:axis_clock_converter:1.1 axis_clock_converter_1

# ---- connections ----

current_bd_instance /scale_offset
connect_bd_intf_net -intf_net float_conv [get_bd_intf_pins float_scale/S_AXIS_A] [get_bd_intf_pins floating_point_0/M_AXIS_RESULT]
connect_bd_intf_net [get_bd_intf_pins float_scale/S_AXIS_A] [get_bd_intf_pins ila_scale_offset/SLOT_1_AXIS]
connect_bd_intf_net -intf_net float_out [get_bd_intf_pins M_AXIS_RESULT] [get_bd_intf_pins float_scale/M_AXIS_RESULT]
connect_bd_intf_net [get_bd_intf_pins M_AXIS_RESULT] [get_bd_intf_pins ila_scale_offset/SLOT_4_AXIS]
connect_bd_intf_net -intf_net int_input [get_bd_intf_pins S_AXIS_A] [get_bd_intf_pins floating_point_0/S_AXIS_A]
connect_bd_intf_net [get_bd_intf_pins S_AXIS_A] [get_bd_intf_pins ila_scale_offset/SLOT_0_AXIS]
connect_bd_net -net float_offset [get_bd_pins xlconstant_6/dout] \
  [get_bd_pins float_scale/s_axis_c_tdata] [get_bd_pins ila_scale_offset/SLOT_3_AXIS_tdata]
connect_bd_net -net float_scale [get_bd_pins xlconstant_5/dout] \
  [get_bd_pins float_scale/s_axis_b_tdata] [get_bd_pins ila_scale_offset/SLOT_2_AXIS_tdata]
connect_bd_net [get_bd_pins xlconstant_7/dout] \
  [get_bd_pins float_scale/s_axis_b_tvalid] [get_bd_pins float_scale/s_axis_c_tvalid] \
  [get_bd_pins ila_scale_offset/SLOT_2_AXIS_tvalid] [get_bd_pins ila_scale_offset/SLOT_3_AXIS_tvalid]
connect_bd_net -net zynq_ultra_ps_e_0_pl_clk0 [get_bd_pins aclk] \
  [get_bd_pins float_scale/aclk] [get_bd_pins floating_point_0/aclk] [get_bd_pins ila_scale_offset/clk]

current_bd_instance /aurora
connect_bd_intf_net [get_bd_intf_pins M_AXIS] [get_bd_intf_pins axis_clock_converter_1/M_AXIS]
connect_bd_intf_net [get_bd_intf_pins GT_DIFF_REFCLK1_0] [get_bd_intf_pins util_ds_buf_2/CLK_IN_D]
connect_bd_intf_net -intf_net GT_SERIAL_RX_0_1 [get_bd_intf_pins GT_SERIAL_RX_0] [get_bd_intf_pins aurora_8b10b_0/GT_SERIAL_RX]
connect_bd_intf_net [get_bd_intf_pins USER_DATA_S_AXI_TX] [get_bd_intf_pins axis_clock_converter_0/S_AXIS]
connect_bd_intf_net [get_bd_intf_pins aurora_8b10b_0/CORE_STATUS] [get_bd_intf_pins CORE_STATUS]
connect_bd_intf_net [get_bd_intf_pins GT_SERIAL_TX_0] [get_bd_intf_pins aurora_8b10b_0/GT_SERIAL_TX]
connect_bd_intf_net [get_bd_intf_pins aurora_8b10b_0/USER_DATA_M_AXI_RX] [get_bd_intf_pins axis_clock_converter_1/S_AXIS]
connect_bd_intf_net [get_bd_intf_pins axis_clock_converter_0/M_AXIS] [get_bd_intf_pins axis_data_fifo_0/S_AXIS]
connect_bd_intf_net [get_bd_intf_pins axis_data_fifo_0/M_AXIS] [get_bd_intf_pins aurora_8b10b_0/USER_DATA_S_AXI_TX]
connect_bd_net [get_bd_pins util_vector_logic_0/Res] \
  [get_bd_pins axis_clock_converter_0/m_axis_aresetn] [get_bd_pins axis_data_fifo_0/s_axis_aresetn] \
  [get_bd_pins axis_clock_converter_1/s_axis_aresetn]
connect_bd_net [get_bd_pins aurora_reset_0/reset] [get_bd_pins aurora_8b10b_0/reset] [get_bd_pins aurora_8b10b_0/gt_reset]
connect_bd_net [get_bd_pins aresetn] [get_bd_pins axis_clock_converter_0/s_axis_aresetn] [get_bd_pins axis_clock_converter_1/m_axis_aresetn]
connect_bd_net [get_bd_pins aurora_8b10b_0/gt_powergood] [get_bd_pins gt_powergood]
connect_bd_net [get_bd_pins aurora_8b10b_0/sys_reset_out] [get_bd_pins util_vector_logic_0/Op1]
connect_bd_net [get_bd_pins aurora_8b10b_0/user_clk_out] \
  [get_bd_pins axis_clock_converter_0/m_axis_aclk] [get_bd_pins axis_data_fifo_0/s_axis_aclk] \
  [get_bd_pins axis_clock_converter_1/s_axis_aclk]
connect_bd_net [get_bd_pins util_ds_buf_2/IBUF_OUT] [get_bd_pins aurora_8b10b_0/gt_refclk1]
connect_bd_net [get_bd_pins xlconstant_5/dout] [get_bd_pins aurora_8b10b_0/loopback]
connect_bd_net [get_bd_pins xlconstant_6/dout] [get_bd_pins aurora_8b10b_0/power_down]
connect_bd_net -net zynq_ultra_ps_e_0_pl_clk0 [get_bd_pins init_clk_in] \
  [get_bd_pins axis_clock_converter_0/s_axis_aclk] [get_bd_pins aurora_reset_0/clk] [get_bd_pins aurora_8b10b_0/init_clk_in] \
  [get_bd_pins axis_clock_converter_1/m_axis_aclk]

current_bd_instance /
connect_bd_intf_net [get_bd_intf_ports GT_DIFF_REFCLK1_0] [get_bd_intf_pins aurora/GT_DIFF_REFCLK1_0]
connect_bd_intf_net -intf_net GT_SERIAL_RX_0_1 [get_bd_intf_ports GT_SERIAL_RX_0] [get_bd_intf_pins aurora/GT_SERIAL_RX_0]
connect_bd_intf_net -intf_net adc1 [get_bd_intf_pins dinoif_fast_1/M00_AXIS] [get_bd_intf_pins scale_offset/S_AXIS_A]
connect_bd_intf_net [get_bd_intf_pins dinoif_fast_1/M00_AXIS] [get_bd_intf_pins system_ila_0/SLOT_4_AXIS]
connect_bd_intf_net -intf_net adc3 [get_bd_intf_pins dinoif_fast_3/M00_AXIS] [get_bd_intf_pins system_ila_0/SLOT_1_AXIS]
connect_bd_intf_net -intf_net adc4 [get_bd_intf_pins dinoif_fast_4/M00_AXIS] [get_bd_intf_pins system_ila_0/SLOT_2_AXIS]
connect_bd_intf_net -intf_net adc5 [get_bd_intf_pins dinoif_fast_5/M00_AXIS] [get_bd_intf_pins system_ila_0/SLOT_5_AXIS]
connect_bd_intf_net -intf_net adc6 [get_bd_intf_pins dinoif_fast_6/M00_AXIS] [get_bd_intf_pins system_ila_0/SLOT_3_AXIS]
connect_bd_intf_net -intf_net adc7 [get_bd_intf_pins dinoif_fast_7/M00_AXIS] [get_bd_intf_pins system_ila_0/SLOT_6_AXIS]
connect_bd_intf_net -intf_net adc8 [get_bd_intf_pins dinoif_fast_8/M00_AXIS] [get_bd_intf_pins system_ila_0/SLOT_7_AXIS]
connect_bd_intf_net -intf_net aurora_8b10b_0_GT_SERIAL_TX [get_bd_intf_ports GT_SERIAL_TX_0] [get_bd_intf_pins aurora/GT_SERIAL_TX_0]
connect_bd_intf_net -intf_net aurora_status [get_bd_intf_pins system_ila_2/SLOT_0_CORE_STATUS_OUT] [get_bd_intf_pins aurora/CORE_STATUS]
connect_bd_intf_net [get_bd_intf_pins zynq_ultra_ps_e_0/S_AXI_HPC0_FPD] [get_bd_intf_pins axi_dma_0/M_AXI]
connect_bd_intf_net [get_bd_intf_pins axi_dma_0/M_AXIS_MM2S] [get_bd_intf_pins axis_interconnect_0/S00_AXIS]
connect_bd_intf_net [get_bd_intf_pins zynq_ultra_ps_e_0/S_AXI_HPC1_FPD] [get_bd_intf_pins axi_dma_0/M_AXI_SG]
connect_bd_intf_net [get_bd_intf_ports I2C0] [get_bd_intf_pins axi_iic_0/IIC]
connect_bd_intf_net [get_bd_intf_pins axi_dma_0/S_AXIS_S2MM] [get_bd_intf_pins axis_interconnect_0/M00_AXIS]
connect_bd_intf_net [get_bd_intf_pins axis_interconnect_0/M01_AXIS] [get_bd_intf_pins axis_interconnect_0/S01_AXIS]
connect_bd_intf_net -intf_net dac1 [get_bd_intf_pins aurora/M_AXIS] [get_bd_intf_pins dinoif_dac_1/S00_AXIS]
connect_bd_intf_net [get_bd_intf_pins aurora/M_AXIS] [get_bd_intf_pins system_ila_0/SLOT_0_AXIS]
connect_bd_intf_net [get_bd_intf_pins axi_dma_0/S_AXI_LITE] [get_bd_intf_pins ps8_0_axi_periph/M00_AXI]
connect_bd_intf_net [get_bd_intf_pins ps8_0_axi_periph/M01_AXI] [get_bd_intf_pins axi_iic_0/S_AXI]
connect_bd_intf_net [get_bd_intf_pins ps8_0_axi_periph/M02_AXI] [get_bd_intf_pins axis_interconnect_0/S_AXI_CTRL]
connect_bd_intf_net [get_bd_intf_pins scale_offset/M_AXIS_RESULT] [get_bd_intf_pins aurora/USER_DATA_S_AXI_TX]
connect_bd_intf_net [get_bd_intf_ports user_si570_sysclk] [get_bd_intf_pins clk_wiz_0/CLK_IN1_D]
connect_bd_intf_net [get_bd_intf_pins zynq_ultra_ps_e_0/M_AXI_HPM0_FPD] [get_bd_intf_pins ps8_0_axi_periph/S00_AXI]
connect_bd_net -net adc1_active [get_bd_pins dinoif_fast_1/active] [get_bd_pins system_ila_1/probe38] [get_bd_pins xlconcat_0/In0]
connect_bd_net -net adc1_conv [get_bd_pins dinoif_fast_1/conv] [get_bd_ports conv_1] [get_bd_pins system_ila_1/probe0]
connect_bd_net -net adc1_rtt_cycles [get_bd_pins dinoif_fast_1/rtt_cycles] [get_bd_pins system_ila_1/probe25]
connect_bd_net -net adc1_serial_clk [get_bd_pins dinoif_fast_1/serial_clk] [get_bd_ports serial_clk_1] [get_bd_pins system_ila_1/probe1]
connect_bd_net -net adc1_serial_data [get_bd_ports serial_data_1] [get_bd_pins system_ila_1/probe2] [get_bd_pins dinoif_fast_1/serial_data]
connect_bd_net -net adc3_active [get_bd_pins dinoif_fast_3/active] [get_bd_pins system_ila_1/probe26] [get_bd_pins xlconcat_0/In2]
connect_bd_net -net adc3_conv [get_bd_pins dinoif_fast_3/conv] [get_bd_ports conv_3] [get_bd_pins system_ila_1/probe6]
connect_bd_net -net adc3_rtt_cycles [get_bd_pins dinoif_fast_3/rtt_cycles] [get_bd_pins system_ila_1/probe27]
connect_bd_net -net adc3_serial_clk [get_bd_pins dinoif_fast_3/serial_clk] [get_bd_ports serial_clk_3] [get_bd_pins system_ila_1/probe7]
connect_bd_net -net adc3_serial_data [get_bd_ports serial_data_3] [get_bd_pins system_ila_1/probe8] [get_bd_pins dinoif_fast_3/serial_data]
connect_bd_net -net adc4_active [get_bd_pins dinoif_fast_4/active] [get_bd_pins system_ila_1/probe28] [get_bd_pins xlconcat_0/In3]
connect_bd_net -net adc4_conv [get_bd_pins dinoif_fast_4/conv] [get_bd_ports conv_4] [get_bd_pins system_ila_1/probe18]
connect_bd_net -net adc4_rtt_cycles [get_bd_pins dinoif_fast_4/rtt_cycles] [get_bd_pins system_ila_1/probe29]
connect_bd_net -net adc4_serial_clk [get_bd_pins dinoif_fast_4/serial_clk] [get_bd_ports serial_clk_4] [get_bd_pins system_ila_1/probe19]
connect_bd_net -net adc4_serial_data [get_bd_ports serial_data_4] [get_bd_pins system_ila_1/probe15] [get_bd_pins dinoif_fast_4/serial_data]
connect_bd_net -net adc5_active [get_bd_pins dinoif_fast_5/active] [get_bd_pins system_ila_1/probe30] [get_bd_pins xlconcat_0/In4]
connect_bd_net -net adc5_conv [get_bd_pins dinoif_fast_5/conv] [get_bd_ports conv_5] [get_bd_pins system_ila_1/probe12]
connect_bd_net -net adc5_rtt_cycles [get_bd_pins dinoif_fast_5/rtt_cycles] [get_bd_pins system_ila_1/probe31]
connect_bd_net -net adc5_serial_clk [get_bd_pins dinoif_fast_5/serial_clk] [get_bd_ports serial_clk_5] [get_bd_pins system_ila_1/probe13]
connect_bd_net -net adc5_serial_data [get_bd_ports serial_data_5] [get_bd_pins system_ila_1/probe14] [get_bd_pins dinoif_fast_5/serial_data]
connect_bd_net -net adc6_active [get_bd_pins dinoif_fast_6/active] [get_bd_pins system_ila_1/probe32] [get_bd_pins xlconcat_0/In5]
connect_bd_net -net adc6_conv [get_bd_pins dinoif_fast_6/conv] [get_bd_ports conv_6] [get_bd_pins system_ila_1/probe9]
connect_bd_net -net adc6_rtt_cycles [get_bd_pins dinoif_fast_6/rtt_cycles] [get_bd_pins system_ila_1/probe33]
connect_bd_net -net adc6_serial_clk [get_bd_pins dinoif_fast_6/serial_clk] [get_bd_ports serial_clk_6] [get_bd_pins system_ila_1/probe10]
connect_bd_net -net adc6_serial_data [get_bd_ports serial_data_6] [get_bd_pins system_ila_1/probe11] [get_bd_pins dinoif_fast_6/serial_data]
connect_bd_net -net adc7_active [get_bd_pins dinoif_fast_7/active] [get_bd_pins system_ila_1/probe34] [get_bd_pins xlconcat_0/In6]
connect_bd_net -net adc7_conv [get_bd_pins dinoif_fast_7/conv] [get_bd_ports conv_7] [get_bd_pins system_ila_1/probe20]
connect_bd_net -net adc7_rtt_cycles [get_bd_pins dinoif_fast_7/rtt_cycles] [get_bd_pins system_ila_1/probe35]
connect_bd_net -net adc7_serial_clk [get_bd_pins dinoif_fast_7/serial_clk] [get_bd_ports serial_clk_7] [get_bd_pins system_ila_1/probe21]
connect_bd_net -net adc7_serial_data [get_bd_ports serial_data_7] [get_bd_pins system_ila_1/probe16] [get_bd_pins dinoif_fast_7/serial_data]
connect_bd_net -net adc8_active [get_bd_pins dinoif_fast_8/active] [get_bd_pins system_ila_1/probe36] [get_bd_pins xlconcat_0/In7]
connect_bd_net -net adc8_conv [get_bd_pins dinoif_fast_8/conv] [get_bd_ports conv_8] [get_bd_pins system_ila_1/probe22]
connect_bd_net -net adc8_rtt_cycles [get_bd_pins dinoif_fast_8/rtt_cycles] [get_bd_pins system_ila_1/probe37]
connect_bd_net -net adc8_serial_clk [get_bd_pins dinoif_fast_8/serial_clk] [get_bd_ports serial_clk_8] [get_bd_pins system_ila_1/probe23]
connect_bd_net -net adc8_serial_data [get_bd_ports serial_data_8] [get_bd_pins system_ila_1/probe17] [get_bd_pins dinoif_fast_8/serial_data]
connect_bd_net -net aurora_powergood [get_bd_pins aurora/gt_powergood] [get_bd_pins system_ila_2/probe0]
connect_bd_net [get_bd_pins axi_dma_0/mm2s_introut] [get_bd_pins xlconcat_1/In1]
connect_bd_net [get_bd_pins axi_dma_0/s2mm_introut] [get_bd_pins xlconcat_1/In0]
connect_bd_net [get_bd_pins axi_iic_0/iic2intc_irpt] [get_bd_pins xlconcat_1/In2]
connect_bd_net -net clk_wiz_0_clk_out1 [get_bd_pins clk_wiz_0/clk_20mhz] \
  [get_bd_pins config_timer_1/clk] [get_bd_pins dinoif_dac_1/clk_20mhz] [get_bd_pins dinoif_fast_3/clk_20mhz] \
  [get_bd_pins dinoif_fast_1/clk_20mhz] [get_bd_pins dinoif_fast_5/clk_20mhz] [get_bd_pins dinoif_fast_6/clk_20mhz] \
  [get_bd_pins dinoif_fast_4/clk_20mhz] [get_bd_pins dinoif_fast_7/clk_20mhz] [get_bd_pins dinoif_fast_8/clk_20mhz]
connect_bd_net [get_bd_pins clk_wiz_0/locked] \
  [get_bd_pins config_timer_1/resetn] [get_bd_pins system_ila_0/resetn] [get_bd_pins aurora/aresetn] \
  [get_bd_pins dinoif_dac_1/resetn] [get_bd_pins dinoif_fast_3/resetn] [get_bd_pins dinoif_fast_1/resetn] \
  [get_bd_pins dinoif_fast_5/resetn] [get_bd_pins dinoif_fast_6/resetn] [get_bd_pins dinoif_fast_4/resetn] \
  [get_bd_pins dinoif_fast_7/resetn] [get_bd_pins dinoif_fast_8/resetn]
connect_bd_net [get_bd_pins config_timer_1/thresh] \
  [get_bd_pins dinoif_dac_1/begin_conv] [get_bd_pins dinoif_fast_3/begin_conv] [get_bd_pins dinoif_fast_1/begin_conv] \
  [get_bd_pins dinoif_fast_5/begin_conv] [get_bd_pins dinoif_fast_6/begin_conv] [get_bd_pins dinoif_fast_4/begin_conv] \
  [get_bd_pins dinoif_fast_7/begin_conv] [get_bd_pins dinoif_fast_8/begin_conv]
connect_bd_net -net dac1_active [get_bd_pins dinoif_dac_1/active] [get_bd_pins system_ila_1/probe24] [get_bd_pins xlconcat_0/In1]
connect_bd_net -net dac1_conv [get_bd_pins dinoif_dac_1/load] [get_bd_ports conv_2] [get_bd_pins system_ila_1/probe3]
connect_bd_net -net dac1_serial_clk [get_bd_pins dinoif_dac_1/serial_clk] [get_bd_ports serial_clk_2] [get_bd_pins system_ila_1/probe4]
connect_bd_net -net dac1_serial_data [get_bd_pins dinoif_dac_1/serial_data] [get_bd_ports serial_data_2] [get_bd_pins system_ila_1/probe5]
connect_bd_net [get_bd_ports reset] [get_bd_pins clk_wiz_0/reset] [get_bd_pins rst_ps8_0_99M/ext_reset_in]
connect_bd_net [get_bd_pins rst_ps8_0_99M/peripheral_aresetn] \
  [get_bd_pins ps8_0_axi_periph/S00_ARESETN] [get_bd_pins axi_iic_0/s_axi_aresetn] [get_bd_pins ps8_0_axi_periph/M00_ARESETN] \
  [get_bd_pins ps8_0_axi_periph/ARESETN] [get_bd_pins ps8_0_axi_periph/M01_ARESETN] [get_bd_pins axi_dma_0/axi_resetn] \
  [get_bd_pins ps8_0_axi_periph/M02_ARESETN] [get_bd_pins axis_interconnect_0/S_AXI_CTRL_ARESETN] \
  [get_bd_pins axis_interconnect_0/S01_AXIS_ARESETN] [get_bd_pins axis_interconnect_0/M01_AXIS_ARESETN] \
  [get_bd_pins axis_interconnect_0/M00_AXIS_ARESETN] [get_bd_pins axis_interconnect_0/S00_AXIS_ARESETN] \
  [get_bd_pins axis_interconnect_0/ARESETN]
connect_bd_net [get_bd_pins xlconcat_0/dout] [get_bd_ports leds]
connect_bd_net [get_bd_pins xlconcat_1/dout] [get_bd_pins zynq_ultra_ps_e_0/pl_ps_irq0]
connect_bd_net [get_bd_pins xlconstant_1/dout] [get_bd_pins config_timer_1/cmp_val]
connect_bd_net [get_bd_pins xlconstant_2/dout] [get_bd_ports serial_clk_de]
connect_bd_net [get_bd_pins xlconstant_3/dout] [get_bd_ports conv_oe]
connect_bd_net [get_bd_pins xlconstant_4/dout] [get_bd_ports serial_data_de]
connect_bd_net [get_bd_pins xlconstant_5/dout] \
  [get_bd_pins zynq_ultra_ps_e_0/saxigp0_awcache] [get_bd_pins zynq_ultra_ps_e_0/saxigp0_arcache] \
  [get_bd_pins zynq_ultra_ps_e_0/saxigp1_awcache] [get_bd_pins zynq_ultra_ps_e_0/saxigp1_arcache]
connect_bd_net [get_bd_pins xlconstant_6/dout] \
  [get_bd_pins zynq_ultra_ps_e_0/saxigp0_awprot] [get_bd_pins zynq_ultra_ps_e_0/saxigp0_arprot] \
  [get_bd_pins zynq_ultra_ps_e_0/saxigp1_awprot] [get_bd_pins zynq_ultra_ps_e_0/saxigp1_arprot]
connect_bd_net -net zynq_ultra_ps_e_0_pl_clk0 [get_bd_pins clk_wiz_0/clk_50mhz] \
  [get_bd_pins system_ila_0/clk] [get_bd_pins system_ila_1/clk] [get_bd_pins scale_offset/aclk] \
  [get_bd_pins system_ila_2/clk] [get_bd_pins aurora/init_clk_in] [get_bd_pins dinoif_dac_1/aclk] \
  [get_bd_pins dinoif_fast_3/aclk] [get_bd_pins dinoif_fast_1/aclk] [get_bd_pins dinoif_fast_5/aclk] \
  [get_bd_pins dinoif_fast_6/aclk] [get_bd_pins dinoif_fast_4/aclk] [get_bd_pins dinoif_fast_7/aclk] \
  [get_bd_pins dinoif_fast_8/aclk]
connect_bd_net [get_bd_pins zynq_ultra_ps_e_0/pl_clk0] \
  [get_bd_pins ps8_0_axi_periph/ACLK] [get_bd_pins zynq_ultra_ps_e_0/maxihpm0_fpd_aclk] \
  [get_bd_pins ps8_0_axi_periph/S00_ACLK] [get_bd_pins rst_ps8_0_99M/slowest_sync_clk] [get_bd_pins axi_iic_0/s_axi_aclk] \
  [get_bd_pins ps8_0_axi_periph/M00_ACLK] [get_bd_pins ps8_0_axi_periph/M01_ACLK] \
  [get_bd_pins zynq_ultra_ps_e_0/saxihpc0_fpd_aclk] [get_bd_pins zynq_ultra_ps_e_0/saxihpc1_fpd_aclk] \
  [get_bd_pins axi_dma_0/s_axi_lite_aclk] [get_bd_pins axi_dma_0/m_axi_sg_aclk] [get_bd_pins axi_dma_0/m_axi_mm2s_aclk] \
  [get_bd_pins axi_dma_0/m_axi_s2mm_aclk] [get_bd_pins axis_interconnect_0/ACLK] \
  [get_bd_pins axis_interconnect_0/S00_AXIS_ACLK] [get_bd_pins axis_interconnect_0/M00_AXIS_ACLK] \
  [get_bd_pins axis_interconnect_0/M01_AXIS_ACLK] [get_bd_pins axis_interconnect_0/S01_AXIS_ACLK] \
  [get_bd_pins ps8_0_axi_periph/M02_ACLK] [get_bd_pins axis_interconnect_0/S_AXI_CTRL_ACLK]
connect_bd_net [get_bd_pins zynq_ultra_ps_e_0/pl_resetn0] [get_bd_pins rst_ps8_0_99M/aux_reset_in]

# ---- address map ----
assign_bd_address -offset 0x0000000000000000 -range 2G -target_address_space [get_bd_addr_spaces axi_dma_0/Data] [get_bd_addr_segs zynq_ultra_ps_e_0/SAXIGP0/HPC0_DDR_LOW]
assign_bd_address -offset 0x00000000C0000000 -range 512M -target_address_space [get_bd_addr_spaces axi_dma_0/Data] [get_bd_addr_segs zynq_ultra_ps_e_0/SAXIGP0/HPC0_QSPI]
assign_bd_address -offset 0x00000000FF000000 -range 16M -target_address_space [get_bd_addr_spaces axi_dma_0/Data] [get_bd_addr_segs zynq_ultra_ps_e_0/SAXIGP0/HPC0_LPS_OCM]
assign_bd_address -offset 0x0000000800000000 -range 32G -target_address_space [get_bd_addr_spaces axi_dma_0/Data] [get_bd_addr_segs zynq_ultra_ps_e_0/SAXIGP0/HPC0_DDR_HIGH]
exclude_bd_addr_seg -offset 0x00000000FF000000 -range 16M -target_address_space [get_bd_addr_spaces axi_dma_0/Data] [get_bd_addr_segs zynq_ultra_ps_e_0/SAXIGP0/HPC0_LPS_OCM]
assign_bd_address -offset 0x0000000000000000 -range 2G -target_address_space [get_bd_addr_spaces axi_dma_0/Data_SG] [get_bd_addr_segs zynq_ultra_ps_e_0/SAXIGP1/HPC1_DDR_LOW]
assign_bd_address -offset 0x00000000C0000000 -range 512M -target_address_space [get_bd_addr_spaces axi_dma_0/Data_SG] [get_bd_addr_segs zynq_ultra_ps_e_0/SAXIGP1/HPC1_QSPI]
assign_bd_address -offset 0x00000000FF000000 -range 16M -target_address_space [get_bd_addr_spaces axi_dma_0/Data_SG] [get_bd_addr_segs zynq_ultra_ps_e_0/SAXIGP1/HPC1_LPS_OCM]
assign_bd_address -offset 0x0000000800000000 -range 32G -target_address_space [get_bd_addr_spaces axi_dma_0/Data_SG] [get_bd_addr_segs zynq_ultra_ps_e_0/SAXIGP1/HPC1_DDR_HIGH]
exclude_bd_addr_seg -offset 0x00000000FF000000 -range 16M -target_address_space [get_bd_addr_spaces axi_dma_0/Data_SG] [get_bd_addr_segs zynq_ultra_ps_e_0/SAXIGP1/HPC1_LPS_OCM]
assign_bd_address -offset 0x00A0000000 -range 64K -target_address_space [get_bd_addr_spaces zynq_ultra_ps_e_0/Data] [get_bd_addr_segs axi_dma_0/S_AXI_LITE/Reg]
assign_bd_address -offset 0x00A0010000 -range 64K -target_address_space [get_bd_addr_spaces zynq_ultra_ps_e_0/Data] [get_bd_addr_segs axis_interconnect_0/xbar/S_AXI_CTRL/Reg]
assign_bd_address -offset 0x00A0020000 -range 64K -target_address_space [get_bd_addr_spaces zynq_ultra_ps_e_0/Data] [get_bd_addr_segs axi_iic_0/S_AXI/Reg]

validate_bd_design
save_bd_design
